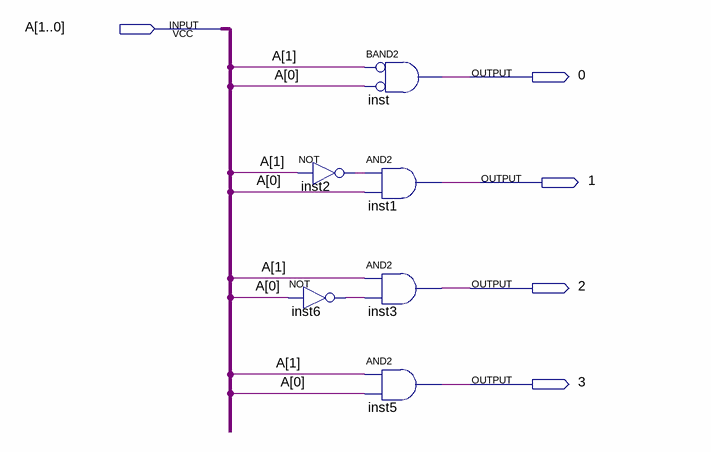
[diagram p0: schematic sheet]
// Quartus schematic 2-to-4_decoder.bdf as structural Verilog: 6 symbols, 5 pins
module \2-to-4_decoder  (
  input  [1:0] A,
  output \0 ,
  output \1 ,
  output \2 ,
  output \3 
);

  wire inst2_out, inst6_out;

  not inst2 (inst2_out, A[1]);
  not inst6 (inst6_out, A[0]);
  and inst (\0 , ~A[1], ~A[0]);  // BAND2
  and inst1 (\1 , inst2_out, A[0]);
  and inst3 (\2 , A[1], inst6_out);
  and inst5 (\3 , A[1], A[0]);
endmodule
